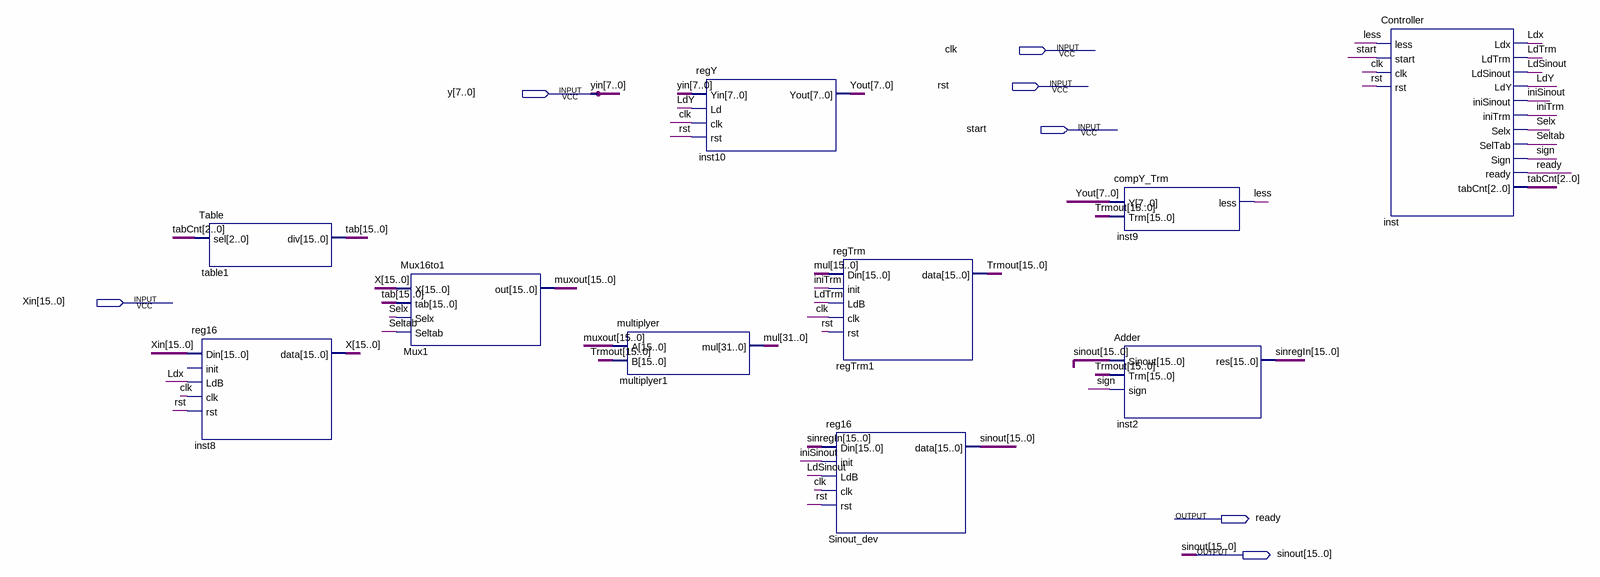
[diagram p0: schematic sheet]
// Quartus schematic sinx.bdf as structural Verilog: 10 symbols, 7 pins
module sinx (
  input  clk,
  input  rst,
  input  [7:0] y,
  input  start,
  input  [15:0] Xin,
  output ready,
  output [15:0] sinout
);

  wire iniSinout, iniTrm, LdSinout, LdTrm, Ldx, LdY, less, Seltab, Selx, sign;
  wire [2:0] tabCnt;
  wire [7:0] Yout;
  wire [15:0] muxout, sinregIn, tab, Trmout, X;
  wire [31:0] mul;

  Table table1 (.sel(tabCnt), .div(tab));
  reg16 inst8 (.Din(Xin), .LdB(Ldx), .clk(clk), .rst(rst), .data(X));  // open: init
  Mux16to1 Mux1 (.X(X), .tab(tab), .Selx(Selx), .Seltab(Seltab), .out(muxout));
  multiplyer multiplyer1 (.A(muxout), .B(Trmout), .mul(mul));
  regY inst10 (.Yin(y), .Ld(LdY), .clk(clk), .rst(rst), .Yout(Yout));
  regTrm regTrm1 (.Din(mul[15:0]), .init(iniTrm), .LdB(LdTrm), .clk(clk), .rst(rst), .data(Trmout));
  reg16 Sinout_dev (.Din(sinregIn), .init(iniSinout), .LdB(LdSinout), .clk(clk), .rst(rst), .data(sinout));
  compY_Trm inst9 (.Y(Yout), .Trm(Trmout), .less(less));
  Adder inst2 (.Sinout(sinout), .Trm(Trmout), .sign(sign), .res(sinregIn));
  Controller inst (
    .less(less), .start(start), .clk(clk), .rst(rst), .Ldx(Ldx), .LdTrm(LdTrm), .LdSinout(LdSinout),
    .LdY(LdY), .iniSinout(iniSinout), .iniTrm(iniTrm), .Selx(Selx), .SelTab(Seltab), .Sign(sign),
    .ready(ready), .tabCnt(tabCnt));

  // Other names for the same wires on the sheet: yin[7:0] = y
endmodule
